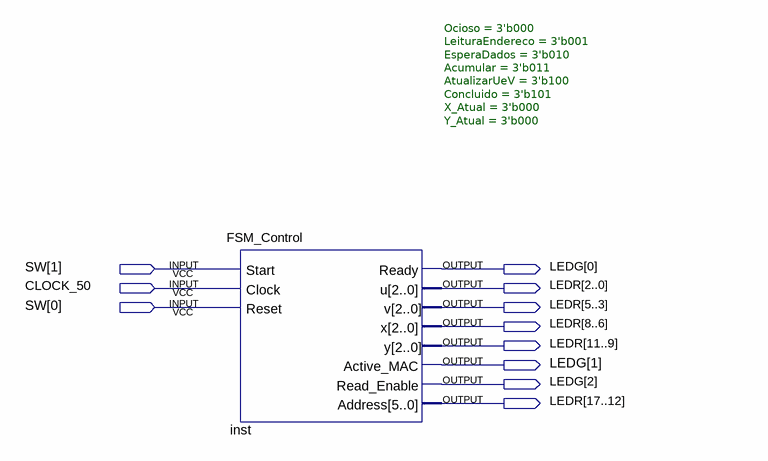
[diagram p0: schematic sheet]
// Quartus schematic FSM.bdf as structural Verilog: 1 symbols, 11 pins
module FSM (
  input  [1:0] SW,
  input  CLOCK_50,
  output [2:0] LEDG,
  output [17:0] LEDR
);

  FSM_Control #(.Ocioso(3'b000), .LeituraEndereco(3'b001), .EsperaDados(3'b010), .Acumular(3'b011), .AtualizarUeV(3'b100), .Concluido(3'b101), .X_Atual(3'b000), .Y_Atual(3'b000)) inst (
    .Start(SW[1]), .Clock(CLOCK_50), .Reset(SW[0]), .Ready(LEDG[0]), .u(LEDR[2:0]), .v(LEDR[5:3]),
    .x(LEDR[8:6]), .y(LEDR[11:9]), .Active_MAC(LEDG[1]), .Read_Enable(LEDG[2]), .Address(LEDR[17:12]));
endmodule
